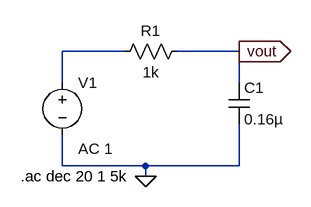
[diagram p0: schematic Low Pass Filter  Circuit.asc]
Low Pass Filter  Circuit.asc, the LTspice schematic file:
Version 4
SHEET 1 880 680
WIRE 240 224 144 224
WIRE 416 224 320 224
WIRE 144 272 144 224
WIRE 416 272 416 224
WIRE 144 400 144 352
WIRE 272 400 144 400
WIRE 416 400 416 336
WIRE 416 400 272 400
WIRE 272 416 272 400
FLAG 272 416 0
FLAG 416 224 vout
IOPIN 416 224 Out
SYMBOL voltage 144 256 R0
WINDOW 123 24 118 Left 2
SYMATTR Value2 AC 1
SYMATTR InstName V1
SYMATTR Value ""
SYMBOL res 336 208 R90
WINDOW 0 0 56 VBottom 2
WINDOW 3 32 56 VTop 2
SYMATTR InstName R1
SYMATTR Value 1k
SYMBOL cap 400 272 R0
SYMATTR InstName C1
SYMATTR Value 0.16µ
TEXT 80 416 Left 2 !.ac dec 20 1 5k

The netlist it stands for:
* Low Pass Filter  Circuit.asc
V1 N001 0 AC 1
R1 vout N001 1k
C1 vout 0 0.16µ
.ac dec 20 1 5k
.backanno
.end